# Altium project nfc-epd.PrjPcb
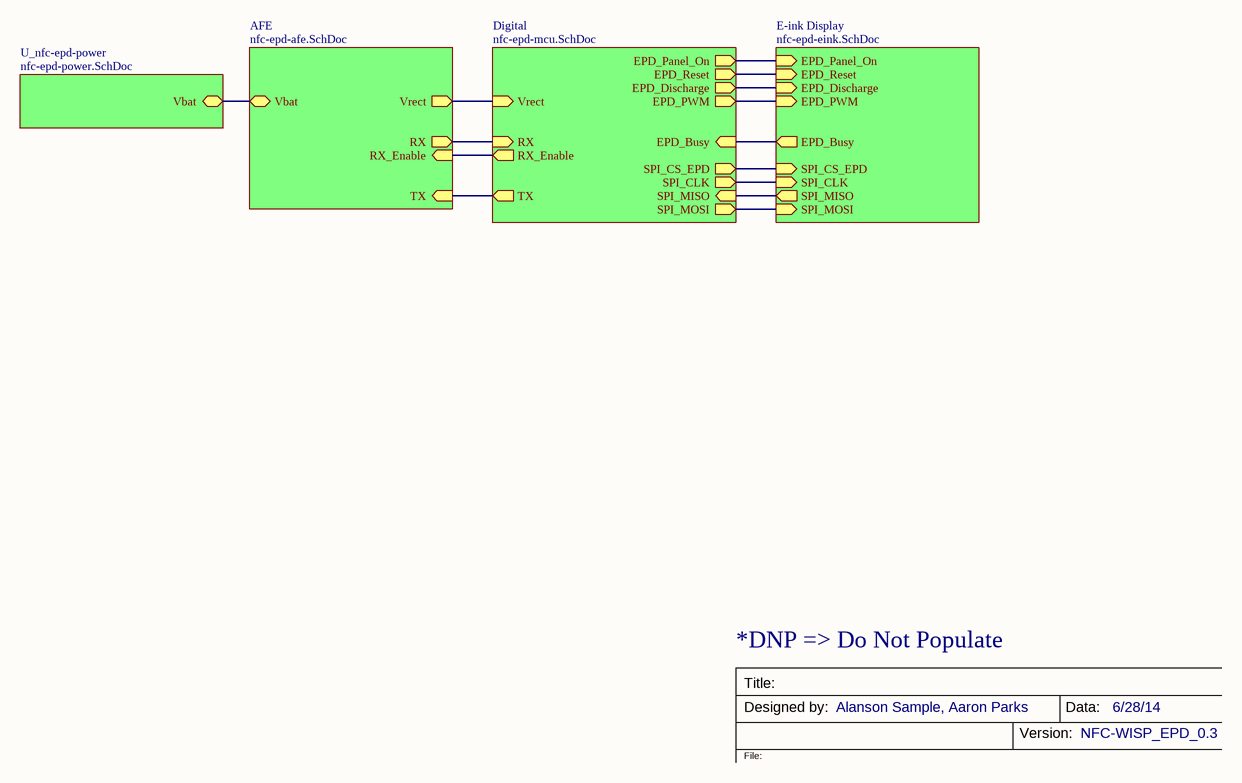
[diagram p0: nfc-epd-top.SchDoc]
5 sheets, 87 parts. Net scope: hierarchical (ports join the sheet entries above them; power ports are global).
Board file: nfc-epd-sm.PcbDoc
Sheets:
  nfc-epd-top.SchDoc
    Digital = nfc-epd-mcu.SchDoc
    AFE = nfc-epd-afe.SchDoc
    E-ink Display = nfc-epd-eink.SchDoc
    U_nfc-epd-power = nfc-epd-power.SchDoc

## Sheet nfc-epd-top.SchDoc
size Letter

### Sub-sheets
AFE = nfc-epd-afe.SchDoc: RX (out), TX (in), RX_Enable (in), Vrect (out), Vbat (bidir)
Digital = nfc-epd-mcu.SchDoc: RX (in), TX (out), SPI_MOSI (out), SPI_MISO (in), SPI_CLK (out), SPI_CS_EPD (out), EPD_Busy (in), EPD_Reset (out), EPD_Panel_On (out), EPD_Discharge (out), EPD_PWM (out), RX_Enable (out), Vrect (in)
E-ink Display = nfc-epd-eink.SchDoc: SPI_CS_EPD (in), EPD_Busy (out), SPI_CLK (in), SPI_MOSI (in), SPI_MISO (out), EPD_Reset (in), EPD_Panel_On (in), EPD_Discharge (in), EPD_PWM (in)
U_nfc-epd-power = nfc-epd-power.SchDoc: Vbat (bidir)

### Nets
EPD_Busy: sheet Digital/EPD_Busy, sheet E-ink Display/EPD_Busy
EPD_Discharge: sheet Digital/EPD_Discharge, sheet E-ink Display/EPD_Discharge
EPD_Panel_On: sheet Digital/EPD_Panel_On, sheet E-ink Display/EPD_Panel_On
EPD_PWM: sheet Digital/EPD_PWM, sheet E-ink Display/EPD_PWM
EPD_Reset: sheet Digital/EPD_Reset, sheet E-ink Display/EPD_Reset
RX: sheet Digital/RX, sheet AFE/RX
RX_Enable: sheet Digital/RX_Enable, sheet AFE/RX_Enable
SPI_CLK: sheet Digital/SPI_CLK, sheet E-ink Display/SPI_CLK
SPI_CS_EPD: sheet Digital/SPI_CS_EPD, sheet E-ink Display/SPI_CS_EPD
SPI_MISO: sheet Digital/SPI_MISO, sheet E-ink Display/SPI_MISO
SPI_MOSI: sheet Digital/SPI_MOSI, sheet E-ink Display/SPI_MOSI
TX: sheet Digital/TX, sheet AFE/TX
Vbat: sheet AFE/Vbat, sheet U_nfc-epd-power/Vbat
Vrect: sheet Digital/Vrect, sheet AFE/Vrect

### Notes on the sheet
- *DNP => Do Not Populate
- Title:
- Designed by:
- Alanson Sample, Aaron Parks
- Version:
- Data:
- NFC-WISP_EPD_0.3
- 6/28/14
- File:

## Sheet nfc-epd-mcu.SchDoc
size Letter
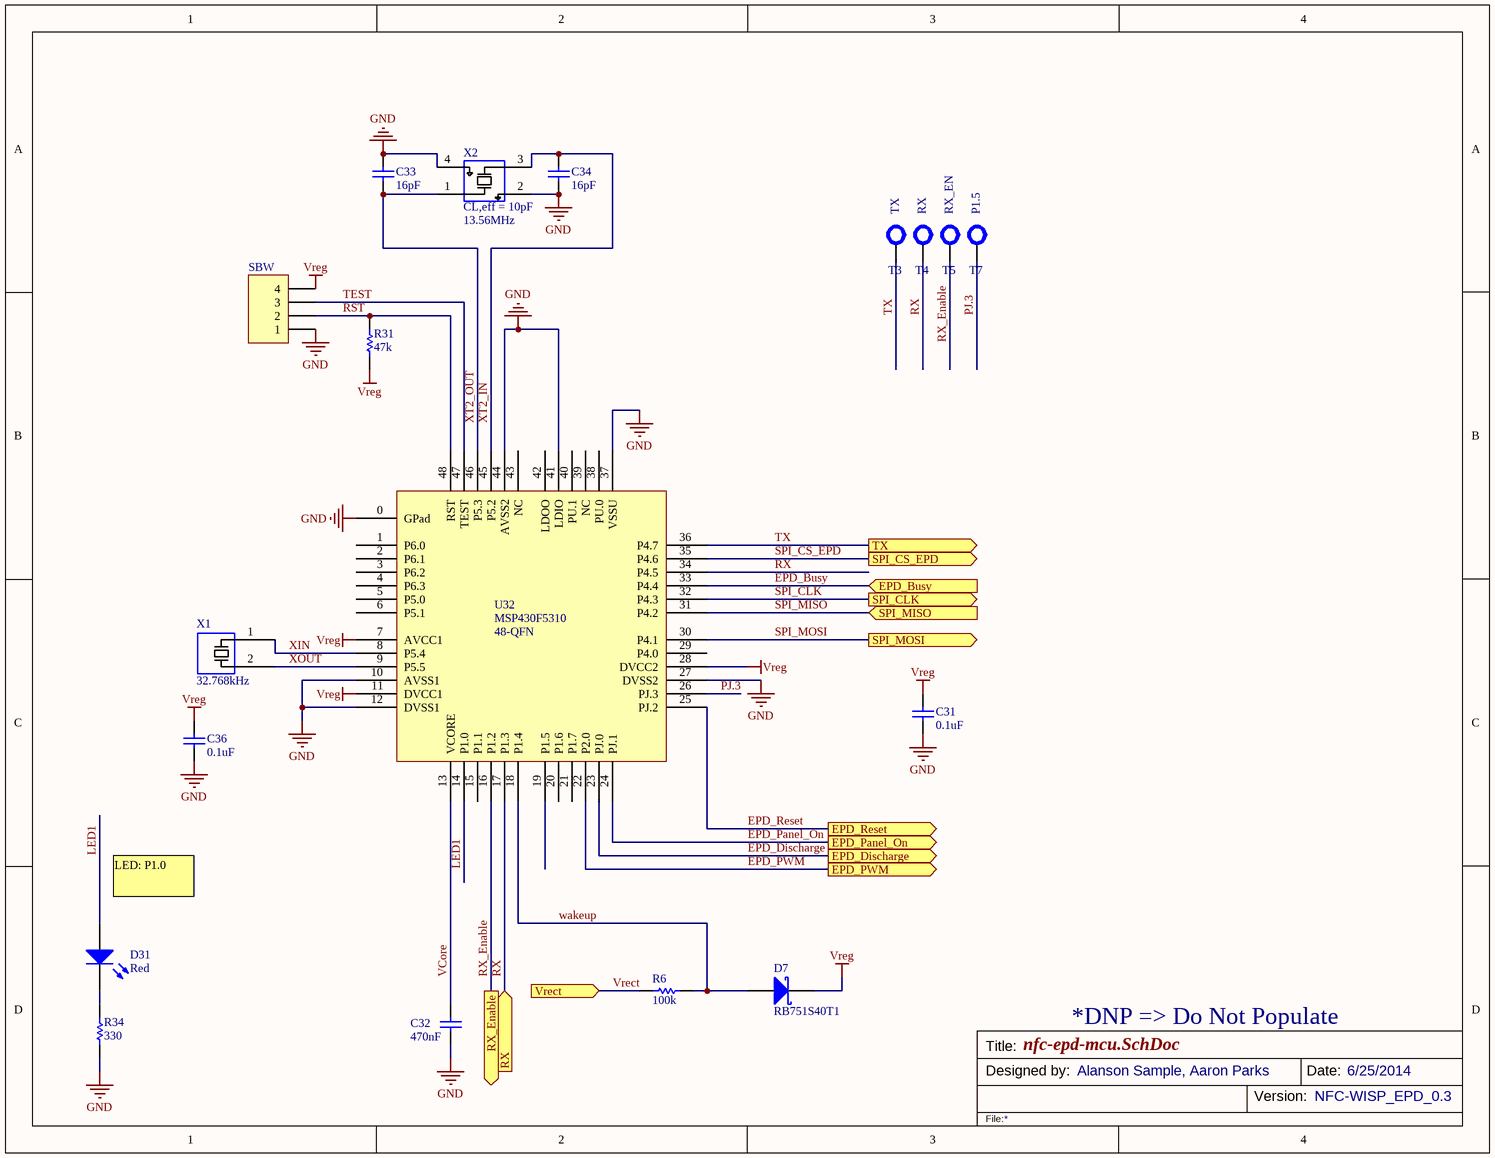
[diagram p1: nfc-epd-mcu.SchDoc]

### Parts
C31  value 0.1uF  [0402]  (hidden comment: Cap)
C32  value 470nF  [0402]  (hidden comment: Cap)
C33  value 16pF  [0402]  (hidden comment: Cap)
C34  value 16pF  [0402]  (hidden comment: Cap)
C36  value 0.1uF  [0402]  (hidden comment: Cap)
D7  RB751S40T1  [SOD-523]
D31  value Red  [Diode - 0603]  (hidden comment: LED)
R6  value 100k  [0402]  (hidden comment: Res)
R31  value 47k  [0402]  (hidden comment: Res)
R34  value 330  [0402]  (hidden comment: Res)
SBW  MHDR1X4  [MHDR1X4]  (value not drawn)
T3  Note: TX  [Test Point - Super Small]  (hidden comment: Test Point)
T4  Note: RX  [Test Point - Super Small]  (hidden comment: Test Point)
T5  Note: RX_EN  [Test Point - Super Small]  (hidden comment: Test Point)
T7  Note: P1.5  [Test Point - Super Small]  (hidden comment: Test Point)
U32  MSP430F5310  [48-QFN]
X1  value 32.768kHz  [XTAL - 2Pin [3.2mm x 1.5mm]]  (hidden comment: XTAL)
X2  value 13.56MHz  Rating: CL,eff = 10pF  [XTAL - 4Pin [3.2MM X 2.5MM]]  (hidden comment: XTAL 4pin)

### Ports
EPD_Busy (in), EPD_Discharge (out), EPD_Panel_On (out), EPD_PWM (out), EPD_Reset (out), RX (in), RX_Enable (out), SPI_CLK (out), SPI_CS_EPD (out), SPI_MISO (in), SPI_MOSI (out), TX (out), Vrect (in)

### Nets
GND: C31.1 C32.2 C33.2 C34.1 C36.1 R34.1 SBW.1 U32.0(GPad) U32.10(AVSS1) U32.12(DVSS1) U32.27(DVSS2) U32.37(VSSU) U32.41(LDIO) U32.44(AVSS2) X2.2(Gnd) X2.4(Gnd)
Vreg: C31.2 C36.2 D7.2(C) R31.2 SBW.4 U32.7(AVCC1) U32.11(DVCC1) U32.28(DVCC2)
EPD_Busy: U32.33(P4.4) ; port EPD_Busy
EPD_Discharge: U32.23(PJ.0) ; port EPD_Discharge
EPD_Panel_On: U32.24(PJ.1) ; port EPD_Panel_On
EPD_PWM: U32.22(P2.0) ; port EPD_PWM
EPD_Reset: U32.25(PJ.2) ; port EPD_Reset
LED1: D31.1(A) U32.14(P1.0)
PJ.3: T7.0 U32.26(PJ.3)
RST: R31.1 SBW.2 U32.48(RST)
RX: T4.0 U32.17(P1.3) U32.34(P4.5) ; port RX
RX_Enable: T5.0 U32.16(P1.2) ; port RX_Enable
SPI_CLK: U32.32(P4.3) ; port SPI_CLK
SPI_CS_EPD: U32.35(P4.6) ; port SPI_CS_EPD
SPI_MISO: U32.31(P4.2) ; port SPI_MISO
SPI_MOSI: U32.30(P4.1) ; port SPI_MOSI
TEST: SBW.3 U32.47(TEST)
TX: T3.0 U32.36(P4.7) ; port TX
VCore: C32.1 U32.13(VCORE)
Vrect: R6.1 ; port Vrect
wakeup: D7.1(A) R6.2 U32.18(P1.4)
XIN: U32.8(P5.4) X1.1
XOUT: U32.9(P5.5) X1.2
XT2_IN: C34.2 U32.45(P5.2) X2.3(XOUT)
XT2_OUT: C33.1 U32.46(P5.3) X2.1(XIN)
NetD31_2: D31.2(K) R34.2

Not connected (* = marked no-connect by the designer): U32 1(P6.0) 2(P6.1) 3(P6.2) 4(P6.3) 5(P5.0) 6(P5.1) 15(P1.1) 19(P1.5) 20(P1.6) 21(P1.7) 29(P4.0) 38(PU.0) 39(NC) 40(PU.1) 42(LDOO) 43(NC)

### Notes on the sheet
- LED: P1.0
- *DNP => Do Not Populate
- Title:
- Designed by:
- Alanson Sample, Aaron Parks
- Version:
- Date:
- NFC-WISP_EPD_0.3
- 6/25/2014
- File:

### Library data of the parts
C31-C34 C36 = Cap: Ceramic Capacitor (Surface Mount); Manufacturer: Generic Ceramic Chip Cap (TBD); Digi-Key Part Number: *; Manufacturer Part Number: *; Note: *; Rating: *
D7 = RB751S40T1: Schottky Diode; Published: 8-Jun-2000; LatestRevisionDate: 17-Jul-2002; LatestRevisionNote: Re-released for DXP Platform.; PackageReference: SMB; Publisher: Altium Limited; Code_JEDEC: DO-214-AA
D31 = Diode - LED: Typical RED, GREEN, YELLOW, AMBER GaAs LED; Digi-Key Part Number: *; Manufacturer: *; Manufacturer Part Number: *; Note: *; Rating: *
R6 R31 R34 = Res: Chip Resistor (Surface Mount); Manufacturer: Generic Chip Res (TBD); Manufacturer Part Number: *; Digi-Key Part Number: *; Rating: *
  R6: Note: *
SBW = MHDR1X4: Header, 4-Pin; LatestRevisionDate: 17-Jul-2002; LatestRevisionNote: Re-released for DXP Platform.; Publisher: Altium Limited
T3-T5 T7 = Test Point: Test Point, large or small foot prints; Manufacturer Part Number: Example: 5000, 5013; Manufacturer: Keystone Electronics; Digi-Key Part Number: Example: 5000K-ND, 5012K-ND, Surface mount 5015KCT-ND; Rating: *; Value: *
U32 = MSP430F5310 - 48Pin: MSP430 - 48LQFP or 48QFN; Manufacturer: Texas Instruments; Manufacturer Part Number: MSP430F5310 (IPTR or IRGZ); Digi-Key Part Number: 296-28193-2-ND or 296-28133-1-ND; Rating: *; Value: *; Note: 48-QFN
X1 = XTAL 2-pins: Crystal Oscillator - [3.20mm x 1.50mm]; Manufacturer: Epson Toyocom Corporation; Manufacturer Part Number: FC-135 32.7680KA-A3; Digi-Key Part Number: example: SE2413CT-ND
X2 = XTAL 4-pins: Crystal - 4-Pin Surface Mount; Manufacturer Part Number: ABM8G-13.560MHZ-B4Y-T; Manufacturer: Abracon Corporation; Digi-Key Part Number: 535-10286-1-ND

## Sheet nfc-epd-afe.SchDoc
size Letter
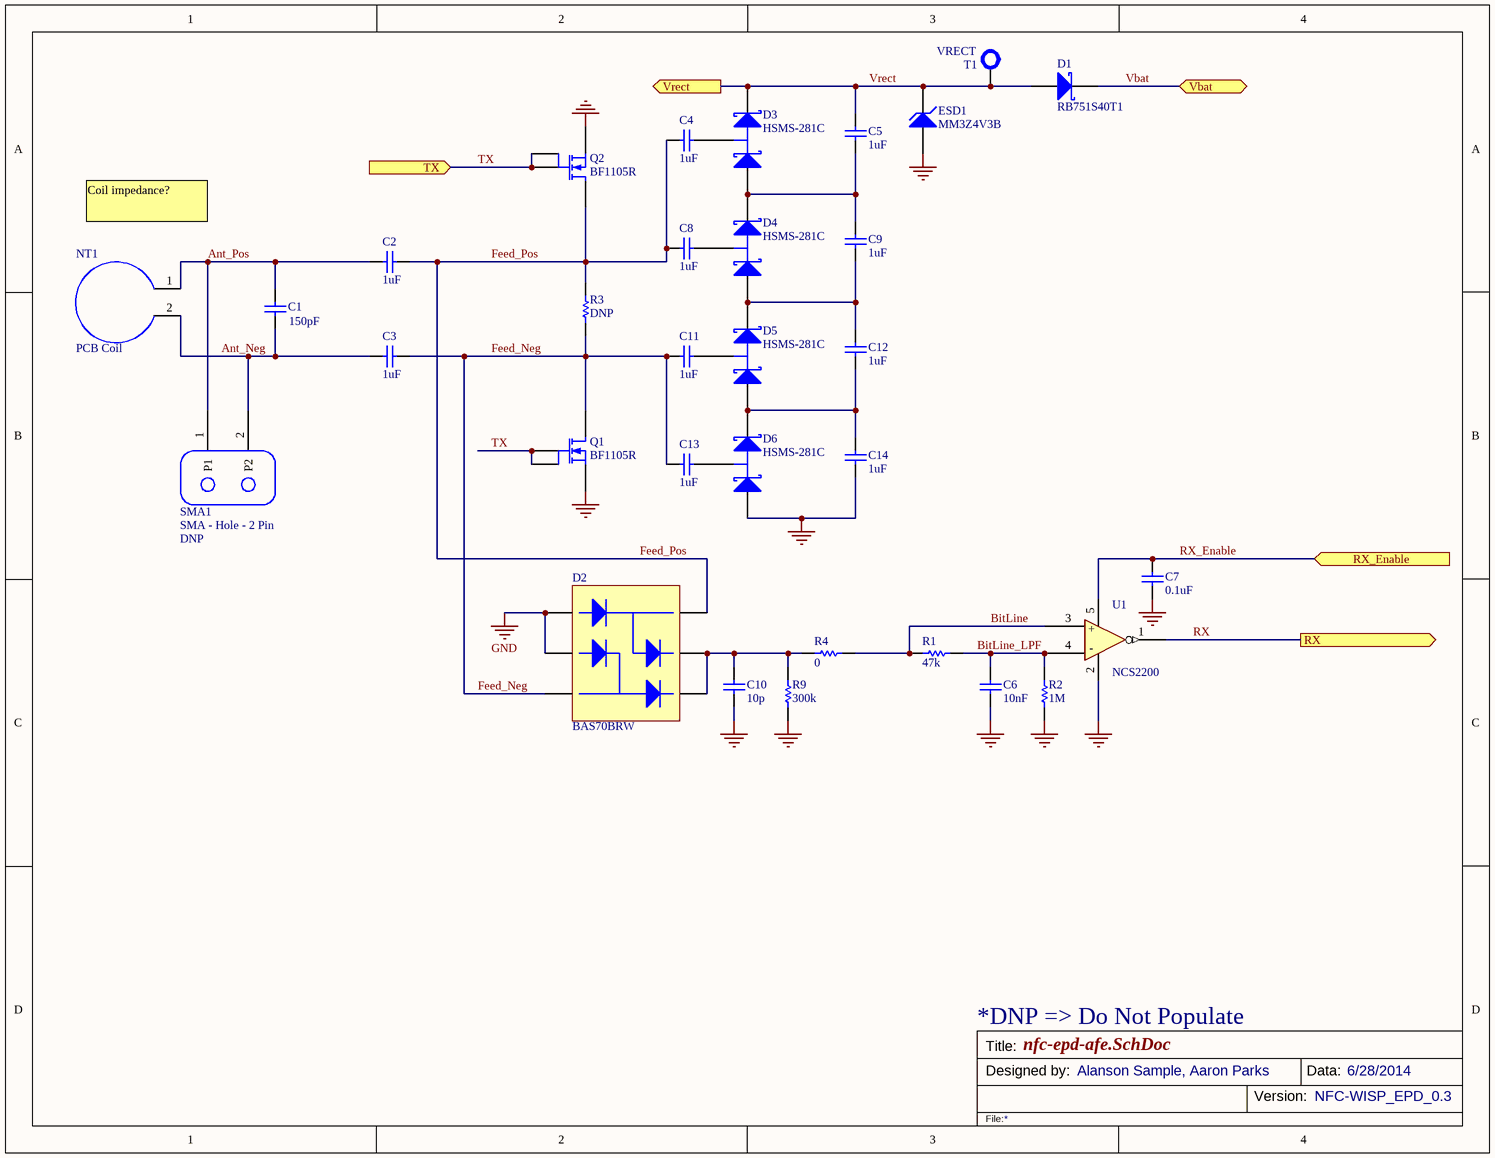
[diagram p2: nfc-epd-afe.SchDoc]

### Parts
C1  value 150pF  [0603]  (hidden comment: Cap)
C2  value 1uF  [0402]  (hidden comment: Cap)
C3  value 1uF  [0402]  (hidden comment: Cap)
C4  value 1uF  [0402]  (hidden comment: Cap)
C5  value 1uF  [0402]  (hidden comment: Cap)
C6  value 10nF  [0402]  (hidden comment: Cap)
C7  value 0.1uF  [0402]  (hidden comment: Cap)
C8  value 1uF  [0402]  (hidden comment: Cap)
C9  value 1uF  [0402]  (hidden comment: Cap)
C10  value 10p  [0402]  (hidden comment: Cap)
C11  value 1uF  [0402]  (hidden comment: Cap)
C12  value 1uF  [0402]  (hidden comment: Cap)
C13  value 1uF  [0402]  (hidden comment: Cap)
C14  value 1uF  [0402]  (hidden comment: Cap)
D1  RB751S40T1  [SOD-523]
D2  BAS70BRW  [SOT-363]
D3  HSMS-281C  [SOT-323, HSMS-285C]
D4  HSMS-281C  [SOT-323, HSMS-285C]
D5  HSMS-281C  [SOT-323, HSMS-285C]
D6  HSMS-281C  [SOT-323, HSMS-285C]
ESD1  MM3Z4V3B  [SOD-323]
NT1  PCB Coil  [Net Tie - 20mil]  (net tie, no BOM)
Q1  BF1105R  [SOT-143R]
Q2  BF1105R  [SOT-143R]
R1  value 47k  [0402]  (hidden comment: Res)
R2  value 1M  [0402]  (hidden comment: Res)
R3  value DNP  [0402]  (hidden comment: Res)
R4  value 0  [0402]  (hidden comment: Res)
R9  value 300k  [0402]  (hidden comment: Res)
SMA1  SMA - Hole - 2 Pin  Note: DNP  [SMA - Hole - 2 Pin]
T1  Note: VRECT  [Test Point - Super Small]  (hidden comment: Test Point)
U1  NCS2200  [SC70-5]

### Ports
RX (out), RX_Enable (in), TX (in), Vbat (bidir), Vrect (out)

### Nets
GND: C6.2 C7.2 C10.2 C14.1 D2.1(A1) D2.2(A2) D6.1(A) ESD1.1(A) Q1.1(S) Q2.1(S) R2.2 R9.2 U1.2(Gnd)
Ant_Neg: C1.2 C3.1 NT1.2(N2) SMA1.2(P2)
Ant_Pos: C1.1 C2.1 NT1.1(N1) SMA1.1(P1)
BitLine: R1.1 R4.2 U1.3(IN+)
BitLine_LPF: C6.1 R1.2 R2.1 U1.4(In-)
Feed_Neg: C3.2 C11.1 C13.1 D2.3(AC2) Q1.2(D) R3.2
Feed_Pos: C2.2 C4.1 C8.1 D2.6(AC1) Q2.2(D) R3.1
RX: U1.1(OUT) ; port RX
RX_Enable: C7.1 U1.5(VDD) ; port RX_Enable
TX: Q1.3(G) Q1.4(G) Q2.3(G) Q2.4(G) ; port TX
Vbat: D1.2(C) ; port Vbat
Vrect: C5.2 D1.1(A) D3.2(K) ESD1.2(C) T1.0 ; port Vrect
NetC4_2: C4.2 D3.3(C)
NetC5_1: C5.1 C9.2 D3.1(A) D4.2(K)
NetC8_2: C8.2 D4.3(C)
NetC9_1: C9.1 C12.2 D4.1(A) D5.2(K)
NetC10_1: C10.1 D2.4(C2) D2.5(C1) R4.1 R9.1
NetC11_2: C11.2 D5.3(C)
NetC12_1: C12.1 C14.2 D5.1(A) D6.2(K)
NetC13_2: C13.2 D6.3(C)

### Notes on the sheet
- Coil impedance?
- *DNP => Do Not Populate
- Title:
- Designed by:
- Alanson Sample, Aaron Parks
- Version:
- Data:
- NFC-WISP_EPD_0.3
- 6/28/2014
- File:
- (in symbol NCS2200) +; -

### Library data of the parts
C1-C14 = Cap: as C31 on sheet nfc-epd-mcu; Digi-Key Part Number: *; Manufacturer Part Number: *; Rating: *
  C2-C14: Note: *
D1 = RB751S40T1: Schottky Diode; Published: 8-Jun-2000; LatestRevisionDate: 17-Jul-2002; LatestRevisionNote: Re-released for DXP Platform.; PackageReference: SMB; Publisher: Altium Limited; Code_JEDEC: DO-214-AA
D2 = Diode - Array_2: Diode Array - 2 Pair Series Connection; Manufacturer: Diodes Inc; Manufacturer Part Number: BAS70BRW-7-F; Note: *; Digi-Key Part Number: BAS70BRW-7FDICT-ND; Value: *; Rating: *
D3-D6 = HSMS-281C: Agilent Schottky Diode, Two in Series, Small Package SOT-323; Manufacturer: Avago Technologies US Inc.; Note: *; Digi-Key Part Number: *not stocked; Manufacturer Part Number: HSMS-281C; Rating: *; Value: *
ESD1 = MM3Z4V3B: Vz=4.3V, Overvoltage Protection Zener; Manufacturer: Fairchild; Manufacturer Part Number: MM3Z4V3B; Digi-Key Part Number: MM3Z4V3BCT-ND; Value: *; Rating: *; Note: *
NT1 = Net Tie - Coil: Hand draw coil symbol based on a 'Net Tie'; Note: A Net Tie is an element that allows two differnt nets to be connected (shorted) together.
Q1 Q2 = BF1105R: SOT-143R, N-Channel Dual-Gate Mos-Fets MOSFET; Manufacturer Part Number: BF1105R,215; Manufacturer: NXP Semiconductors; Digi-Key Part Number: BF1105R,215-ND; Rating: *; Value: *; Note: *
R1-R4 R9 = Res: as R6 on sheet nfc-epd-mcu; Manufacturer Part Number: *; Digi-Key Part Number: *; Rating: *
SMA1 = SMA - Hole - 2 Pin: Two pin SMA connector wisp
T1 = Test Point: as T3 on sheet nfc-epd-mcu; Digi-Key Part Number: Example: 5000K-ND, 5012K-ND, Surface mount 5015KCT-ND; Rating: *; Value: *
U1 = NCS2200: Comparator: On Semi 10uA Comparator; Manufacturer: ON Semiconductor; Manufacturer Part Number: NCS2200SQ2T2G; Digi-Key Part Number: NCS2200SQ2T2GOSTR-ND; Rating: *; Value: *; Note: *

## Sheet nfc-epd-eink.SchDoc
size Letter
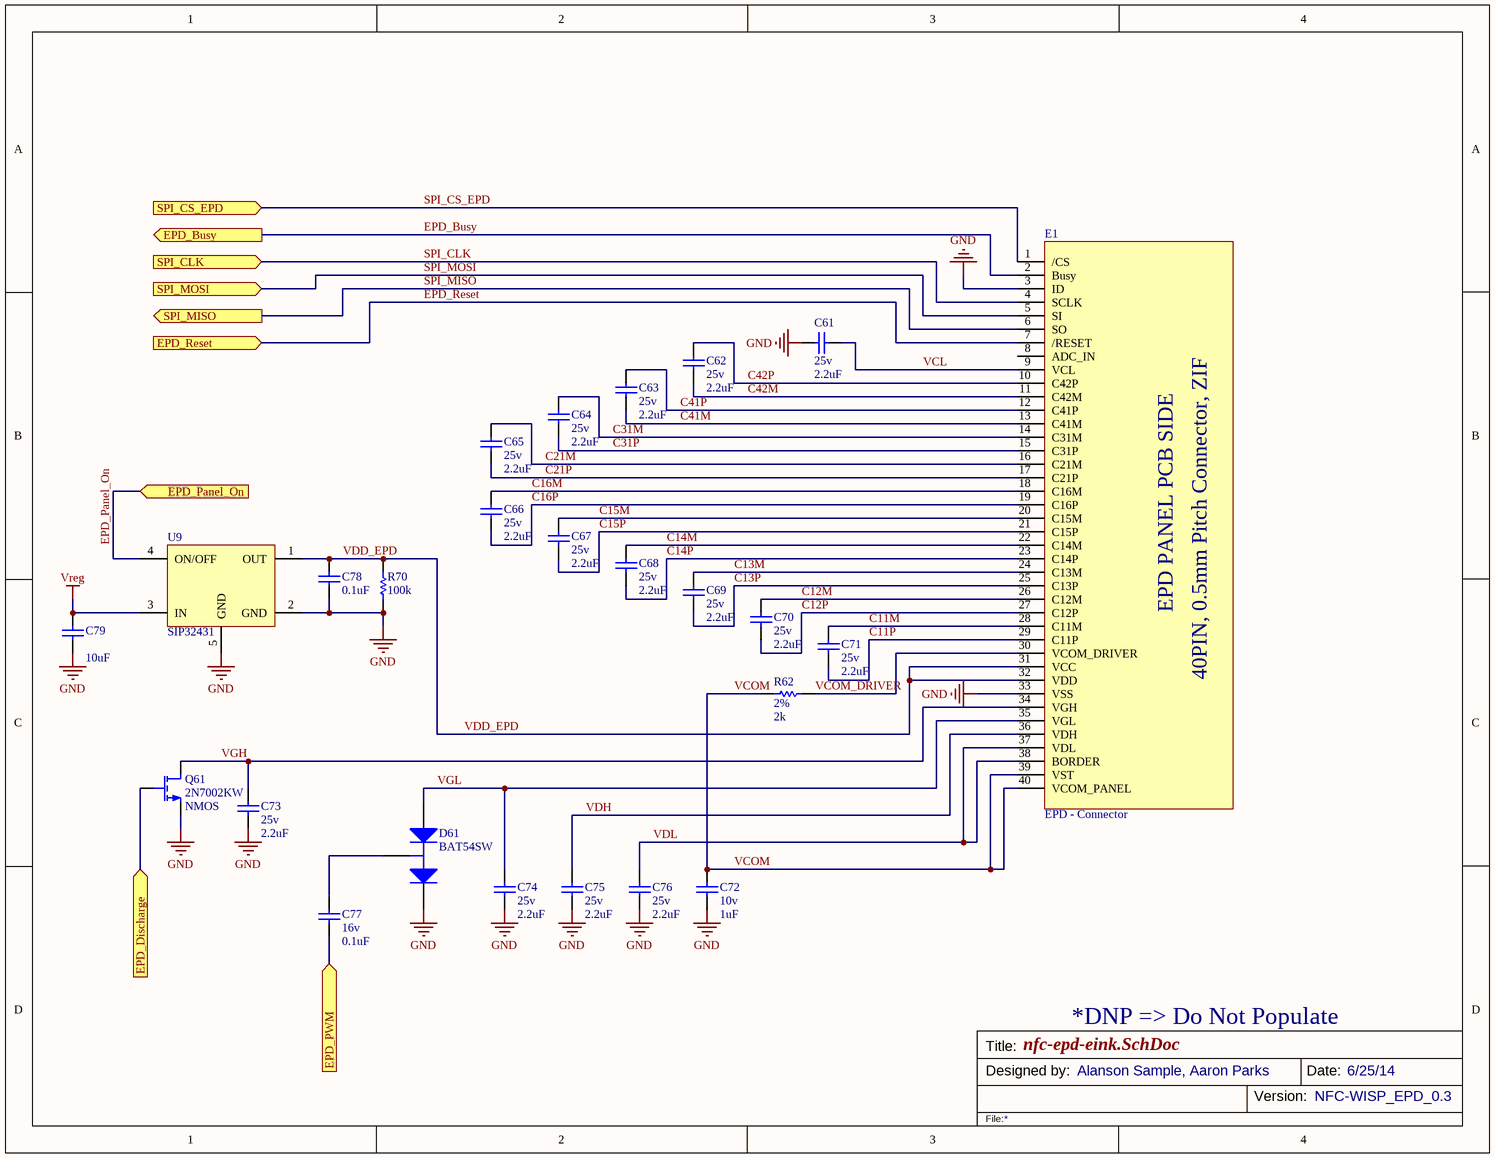
[diagram p3: nfc-epd-eink.SchDoc]

### Parts
C61  value 2.2uF  Rating: 25v  [0402]  (hidden comment: Cap)
C62  value 2.2uF  Rating: 25v  [0402]  (hidden comment: Cap)
C63  value 2.2uF  Rating: 25v  [0402]  (hidden comment: Cap)
C64  value 2.2uF  Rating: 25v  [0402]  (hidden comment: Cap)
C65  value 2.2uF  Rating: 25v  [0402]  (hidden comment: Cap)
C66  value 2.2uF  Rating: 25v  [0402]  (hidden comment: Cap)
C67  value 2.2uF  Rating: 25v  [0402]  (hidden comment: Cap)
C68  value 2.2uF  Rating: 25v  [0402]  (hidden comment: Cap)
C69  value 2.2uF  Rating: 25v  [0402]  (hidden comment: Cap)
C70  value 2.2uF  Rating: 25v  [0402]  (hidden comment: Cap)
C71  value 2.2uF  Rating: 25v  [0402]  (hidden comment: Cap)
C72  value 1uF  Rating: 10v  [0402]  (hidden comment: Cap)
C73  value 2.2uF  Rating: 25v  [0402]  (hidden comment: Cap)
C74  value 2.2uF  Rating: 25v  [0402]  (hidden comment: Cap)
C75  value 2.2uF  Rating: 25v  [0402]  (hidden comment: Cap)
C76  value 2.2uF  Rating: 25v  [0402]  (hidden comment: Cap)
C77  value 0.1uF  Rating: 16v  [0402]  (hidden comment: Cap)
C78  value 0.1uF  [0402]  (hidden comment: Cap)
C79  value 10uF  [0603]  (hidden comment: Cap)
D61  BAT54SW  [SOT-323 / SC-70]
E1  EPD - Connector  [EPD - Connector]
Q61  2N7002KW  value NMOS  [SOT-323 / SC-70]
R62  value 2k  Rating: 2%  [0402]  (hidden comment: Res)
R70  value 100k  [0402]  (hidden comment: Res)
U9  SIP32431  [TDFN-4]

### Ports
EPD_Busy (out), EPD_Discharge (in), EPD_Panel_On (in), EPD_PWM (in), EPD_Reset (in), SPI_CLK (in), SPI_CS_EPD (in), SPI_MISO (out), SPI_MOSI (in)

### Nets
GND: C61.2 C72.1 C73.1 C74.1 C75.1 C76.1 C78.1 C79.1 D61.2(K) E1.3(ID) E1.33(VSS) Q61.2(S) R70.1 U9.2(GND) U9.5(GND)
Vreg: C79.2 U9.3(IN)
C11M: C71.2 E1.28(C11M)
C11P: C71.1 E1.29(C11P)
C12M: C70.1 E1.26(C12M)
C12P: C70.2 E1.27(C12P)
C13M: C69.2 E1.24(C13M)
C13P: C69.1 E1.25(C13P)
C14M: C68.2 E1.22(C14M)
C14P: C68.1 E1.23(C14P)
C15M: C67.2 E1.20(C15M)
C15P: C67.1 E1.21(C15P)
C16M: C66.2 E1.18(C16M)
C16P: C66.1 E1.19(C16P)
C21M: C65.2 E1.16(C21M)
C21P: C65.1 E1.17(C21P)
C31M: C64.2 E1.14(C31M)
C31P: C64.1 E1.15(C31P)
C41M: C63.1 E1.13(C41M)
C41P: C63.2 E1.12(C41P)
C42M: C62.2 E1.11(C42M)
C42P: C62.1 E1.10(C42P)
EPD_Busy: E1.2(Busy) ; port EPD_Busy
EPD_Discharge: Q61.1(G) ; port EPD_Discharge
EPD_Panel_On: U9.4(ON/OFF) ; port EPD_Panel_On
EPD_PWM: C77.1 ; port EPD_PWM
EPD_Reset: E1.7(/RESET) ; port EPD_Reset
SPI_CLK: E1.4(SCLK) ; port SPI_CLK
SPI_CS_EPD: E1.1(/CS) ; port SPI_CS_EPD
SPI_MISO: E1.6(SO) ; port SPI_MISO
SPI_MOSI: E1.5(SI) ; port SPI_MOSI
VCL: C61.1 E1.9(VCL)
VCOM: C72.2 E1.39(VST) E1.40(VCOM_PANEL) R62.2
VCOM_DRIVER: E1.30(VCOM_DRIVER) R62.1
VDD_EPD: C78.2 E1.31(VCC) E1.32(VDD) R70.2 U9.1(OUT)
VDH: C75.2 E1.36(VDH)
VDL: C76.2 E1.37(VDL) E1.38(BORDER)
VGH: C73.2 E1.34(VGH) Q61.3(D)
VGL: C74.2 D61.1(A) E1.35(VGL)
NetC77_2: C77.2 D61.3(C)

Not connected (* = marked no-connect by the designer): E1 8(ADC_IN)

### Notes on the sheet
- *DNP => Do Not Populate
- Title:
- Designed by:
- Alanson Sample, Aaron Parks
- Version:
- Date:
- NFC-WISP_EPD_0.3
- 6/25/14
- File:
- (in symbol EPD - Connector) EPD PANEL PCB SIDE; 40PIN, 0.5mm Pitch Connector, ZIF

### Library data of the parts
C61-C79 = Cap: as C31 on sheet nfc-epd-mcu; Digi-Key Part Number: *; Manufacturer Part Number: *; Note: *
D61 = Diode - Array_1: Diode Array, Two in Series, Small Package SOT-323; Manufacturer: ON Semiconductor; Manufacturer Part Number: BAT54SWT1G; Note: *; Digi-Key Part Number: BAT54SWT1GOSCT-ND or (BAT54SW); Value: *; Rating: *
E1 = EPD - Connector: FPC, 40pin, 0.5mm Pitch - ZIF; Manufacturer: Hirose Electric Co Ltd; Manufacturer Part Number: FH12-40S-0.5SH or FH12S-40S-0.5SH; Digi-Key Part Number: HFJ140CT-ND or HFA140CT-ND; Note: *; Value: *; Rating: *
Q61 = MOSFET-N: N-Channel MOSFET; Manufacturer: Fairchild Semiconductor; Digi-Key Part Number: 2N7002KWCT-ND; Manufacturer Part Number: 2N7002KW; Notes: *; Rating: *
R62 R70 = Res: as R6 on sheet nfc-epd-mcu; Manufacturer Part Number: *; Digi-Key Part Number: *; Note: *
  R70: Rating: *
U9 = SIP32431: High Sside Switch - 4TDFN package; Manufacturer: Vishay Siliconix; Manufacturer Part Number: SIP32431DNP3-T1GE4; Digi-Key Part Number: SIP32431DNP3-T1GE4CT-ND; Note: *; Value: *; Rating: *

## Sheet nfc-epd-power.SchDoc
size Letter
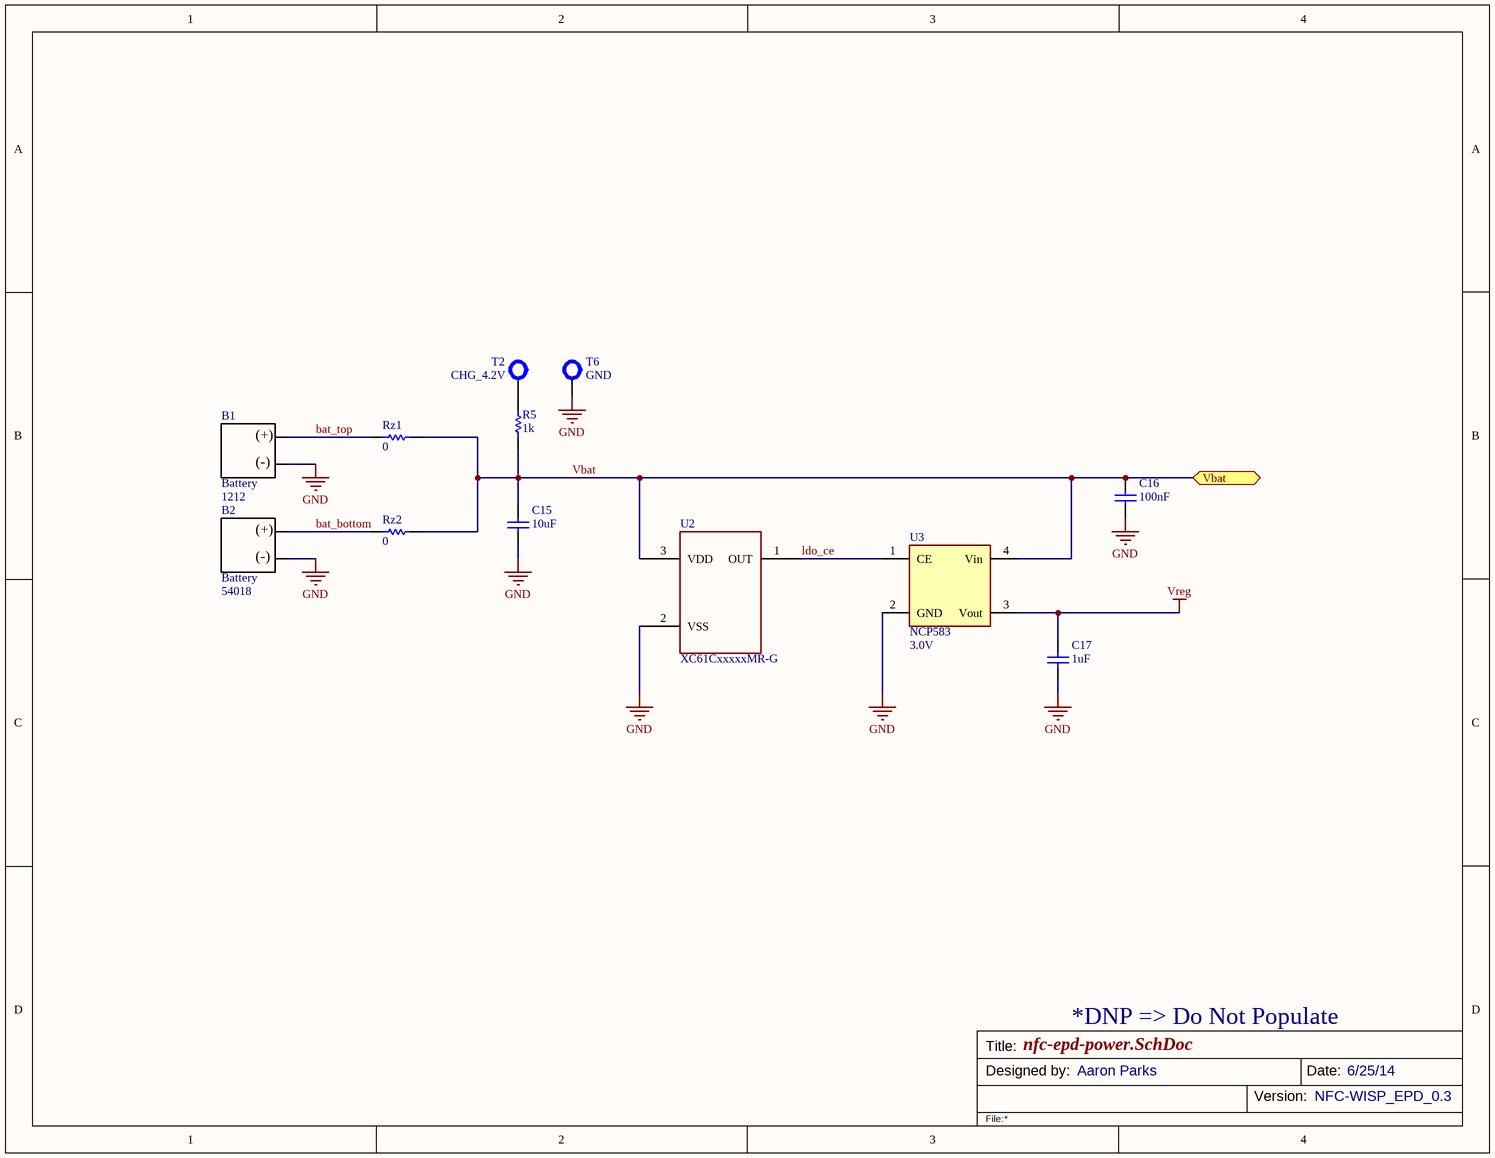
[diagram p4: nfc-epd-power.SchDoc]

### Parts
B1  Battery  Note: 1212  [PGEB0121212]
B2  Battery  Note: 54018  [PGEB0054018]
C15  value 10uF  [0603]  (hidden comment: Cap)
C16  value 100nF  [0402]  (hidden comment: Cap)
C17  value 1uF  [0402]  (hidden comment: Cap)
R5  value 1k  [0402]  (hidden comment: Res)
Rz1  value 0  [0402]  (hidden comment: Res)
Rz2  value 0  [0402]  (hidden comment: Res)
T2  Note: CHG_4.2V  [Test Point - Small]  (hidden comment: Test Point)
T6  Note: GND  [Test Point - Small]  (hidden comment: Test Point)
U2  XC61CxxxxxMR-G  [SOT23 - N]
U3  NCP583  value 3.0V  [SC82-AB]

### Ports
Vbat (bidir)

### Nets
GND: B1.1(BAT_NEG) B2.1(BAT_NEG) C15.1 C16.1 C17.1 T6.0 U2.2(VSS) U3.2(GND)
Vreg: C17.2 U3.3(Vout)
bat_bottom: B2.2(BAT_POS) Rz2.2
bat_top: B1.2(BAT_POS) Rz1.2
ldo_ce: U2.1(OUT) U3.1(CE)
Vbat: C15.2 C16.2 R5.1 Rz1.1 Rz2.1 U2.3(VDD) U3.4(Vin) ; port Vbat
NetR5_2: R5.2 T2.0

### Notes on the sheet
- *DNP => Do Not Populate
- Title:
- Designed by:
- Aaron Parks
- Version:
- Date:
- NFC-WISP_EPD_0.3
- 6/25/14
- File:
- (in symbol Powerstream_Battery) (+); (-)

### Library data of the parts
B1 B2 = Powerstream_Battery: Powerstream Lithium Battery
C15-C17 = Cap: as C31 on sheet nfc-epd-mcu; Digi-Key Part Number: *; Manufacturer Part Number: *; Note: *; Rating: *
R5 Rz1 Rz2 = Res: as R6 on sheet nfc-epd-mcu; Manufacturer Part Number: *; Digi-Key Part Number: *; Rating: *; Note: *
T2 T6 = Test Point: as T3 on sheet nfc-epd-mcu; Digi-Key Part Number: Example: 5000K-ND, 5012K-ND, Surface mount 5015KCT-ND; Rating: *; Value: *
U2 = XC61CxxxxxMR-G: Torex IC Supervisor, SOT-23
U3 = NCP583: Regulator: Ultra-Low Iq 150mA CMOS LDO Regulator with Enable; Manufacturer: ON Semiconductor; Manufacturer Part Number: NCP583SQ18T1G; Digi-Key Part Number: NCP583SQ18T1GOSCT-ND; Rating: *; Note: *

## Nets that join several sheets
GND: nfc-epd-mcu (16 pins), nfc-epd-afe (13 pins), nfc-epd-eink (15 pins), nfc-epd-power (8 pins)
Vreg: nfc-epd-mcu (8 pins), nfc-epd-eink (C79.2 U9.3), nfc-epd-power (C17.2 U3.3)
EPD_Busy: nfc-epd-mcu (U32.33), nfc-epd-eink (E1.2)
EPD_Discharge: nfc-epd-mcu (U32.23), nfc-epd-eink (Q61.1)
EPD_Panel_On: nfc-epd-mcu (U32.24), nfc-epd-eink (U9.4)
EPD_PWM: nfc-epd-mcu (U32.22), nfc-epd-eink (C77.1)
EPD_Reset: nfc-epd-mcu (U32.25), nfc-epd-eink (E1.7)
RX: nfc-epd-mcu (T4.0 U32.17 U32.34), nfc-epd-afe (U1.1)
RX_Enable: nfc-epd-mcu (T5.0 U32.16), nfc-epd-afe (C7.1 U1.5)
SPI_CLK: nfc-epd-mcu (U32.32), nfc-epd-eink (E1.4)
SPI_CS_EPD: nfc-epd-mcu (U32.35), nfc-epd-eink (E1.1)
SPI_MISO: nfc-epd-mcu (U32.31), nfc-epd-eink (E1.6)
SPI_MOSI: nfc-epd-mcu (U32.30), nfc-epd-eink (E1.5)
TX: nfc-epd-mcu (T3.0 U32.36), nfc-epd-afe (Q1.3 Q1.4 Q2.3 Q2.4)
Vbat: nfc-epd-afe (D1.2), nfc-epd-power (7 pins)
Vrect: nfc-epd-mcu (R6.1), nfc-epd-afe (5 pins)